# EAGLE design LilyPad_Vibeboard (EAGLE 6.4)
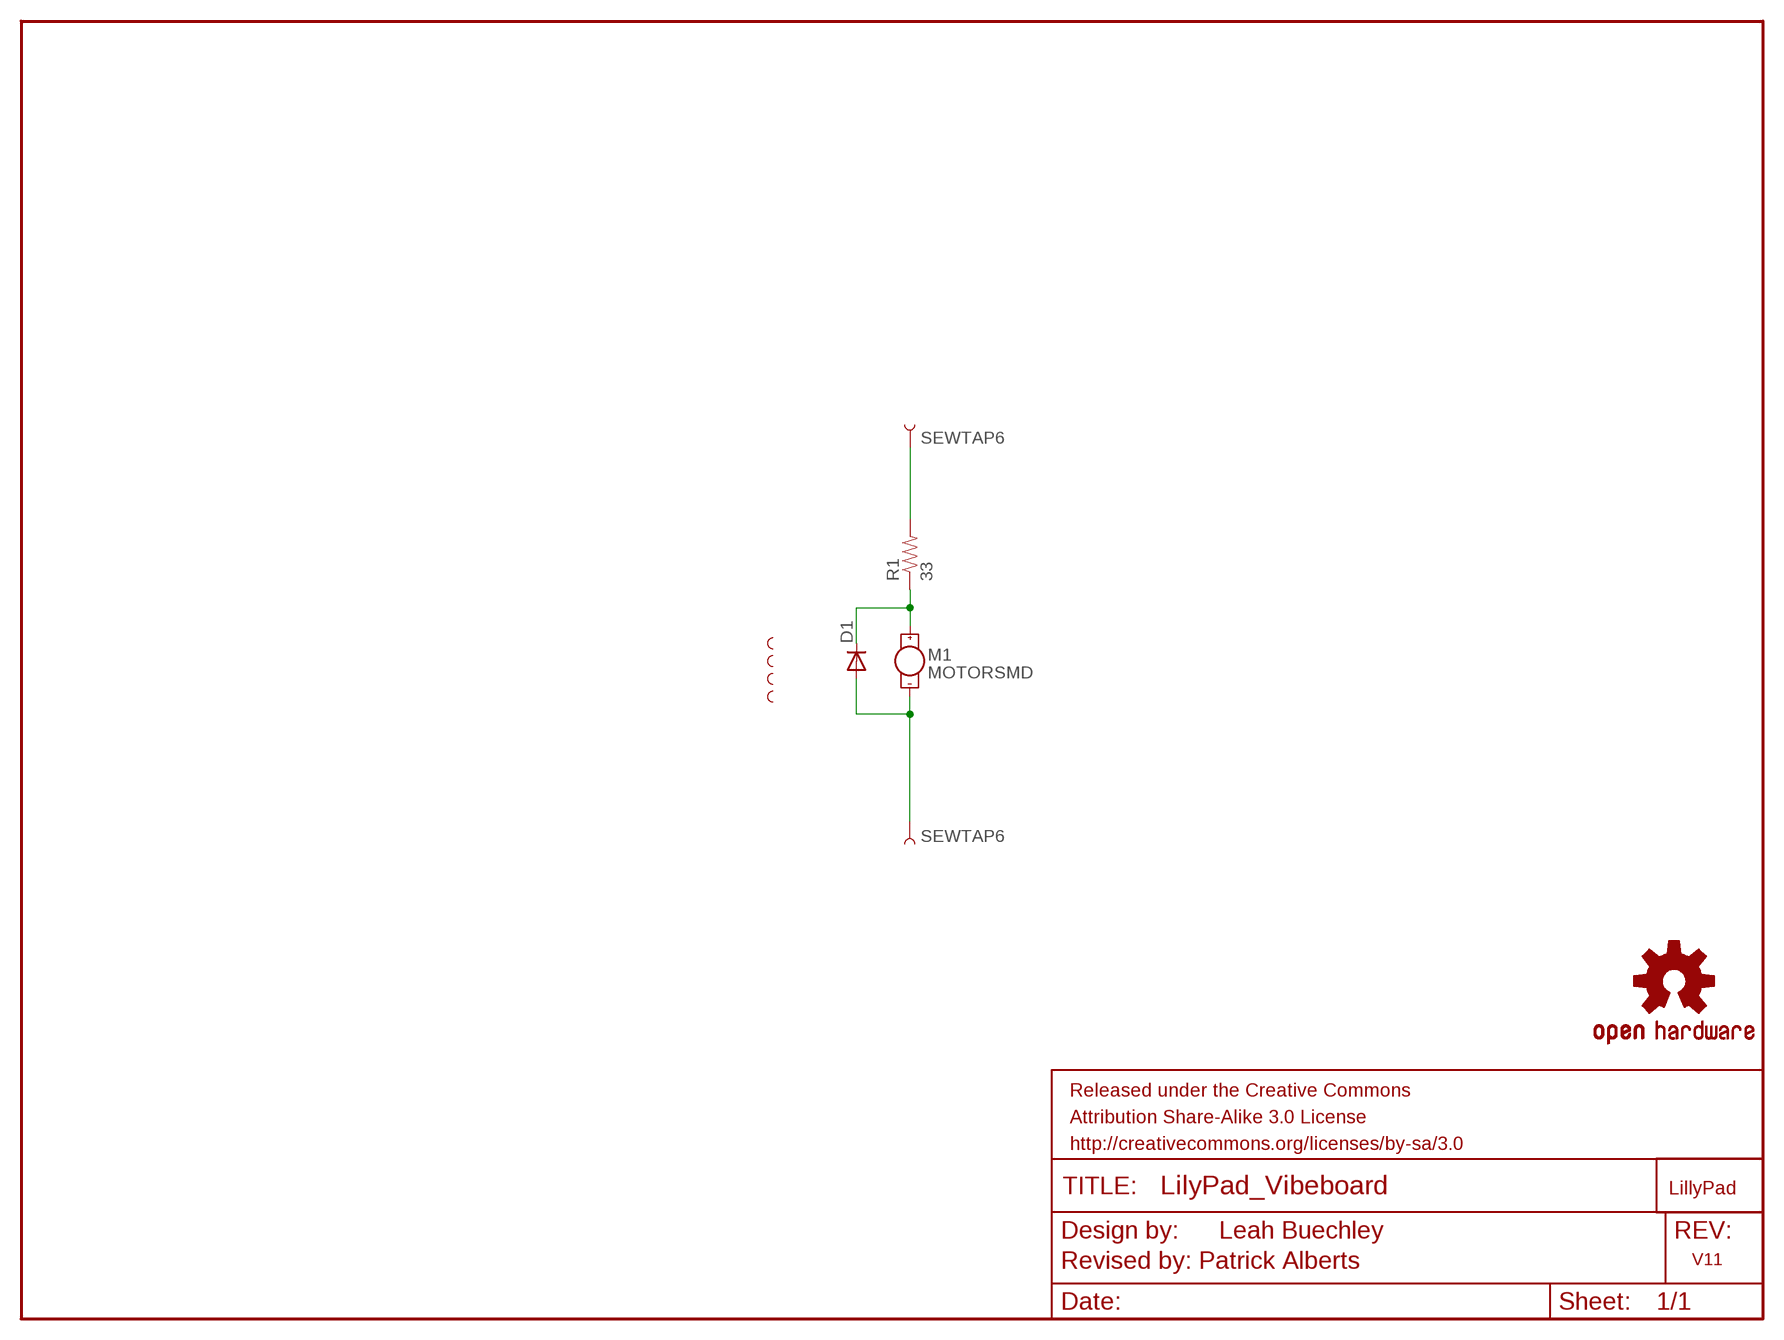
[diagram p0: schematic, sheet 1]

## Parts
D1  DIODESOD  [SOD-323]
FRAME1  FRAME-LETTER  [CREATIVE_COMMONS]
LOGO1  OSHW-LOGOS  [OSHW-LOGO-S]
M1  MOTORSMD  [VIBE-MOTOR-10MM-SMD]
R1  33  33K-1%  [0603-RES]
U$2  LOGO-LPLP  [LOGO-LILYPAD]
VIBE1  SEWTAP-NOHOLE2  [PETAL-NOHOLE-2SIDE]
VIBE2  SEWTAP-NOHOLEW-MASK  [PETAL-NOHOLE-2SIDE-SPECIAL-W-MASK]
VIBE3  SEWTAP-NOHOLE2  [PETAL-NOHOLE-2SIDE]
VIBE4  SEWTAP-NOHOLE2  [PETAL-NOHOLE-2SIDE]
VIBE+  SEWTAP6  [PETAL-SMALL-2SIDE]
VIBE-  SEWTAP6  [PETAL-SMALL-2SIDE]

## Nets
5V: R1.2 VIBE+.1
GND: D1.2(A) M1.P$2(-) VIBE-.1
N$1: D1.1(C) M1.P$1(+) R1.1

## Notes on the sheet
- Leah Buechley
- Revised by: Patrick Alberts | V11

## Library data of the parts
D1 = SparkFun:DIODE: Diode These are standard reverse protection diodes and small signal diodes. SMA package can handle up to about 1A. SOD-323 can handle about 200mA. What the SOD-323 package when ordering, there are some mfgs out there that are 5-pin packages.
FRAME1 = SparkFun-Aesthetics:FRAME-LETTER: Schematic Frame Standard 8.5x11 US Letter frame
LOGO1 = SparkFun-Aesthetics:OSHW-LOGO: Open Source Hardware Logo This logo indicates the piece of hardware it is found on incorporates a OSHW license and/or adheres to the definition of open source hardware found here: http://freedomdefined.org/OSHW
M1 = Testing:MOTOR: Vibration Motor Physical dimension and wire connections for this powerful vibration motor. Motor has a self adhesive backing. Spark Fun Electronics SKU : ROB-08449
R1 = SparkFun-Resistors:33K-1%: 33k-ohm SMT 1/10W - 1% (0603) RES-08416; PROD_ID: RES-08416; VALUE: 33k
U$2 = LilyPad-Wearables:LOGO-LP
VIBE1 VIBE3 VIBE4 = LilyPad-Wearables:SEWTAP-NOHOLE
VIBE2 = Testing:SEWTAP-NOHOLE
VIBE+ VIBE- = LilyPad-Wearables:SEWTAP

## Board
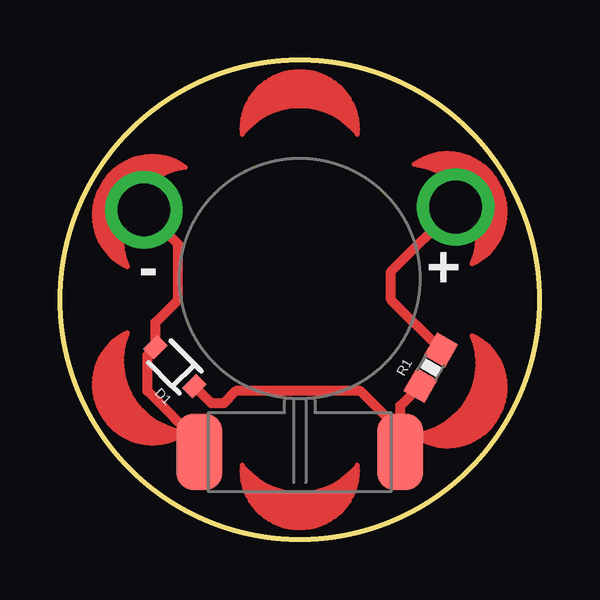
[diagram p1: board, top side]
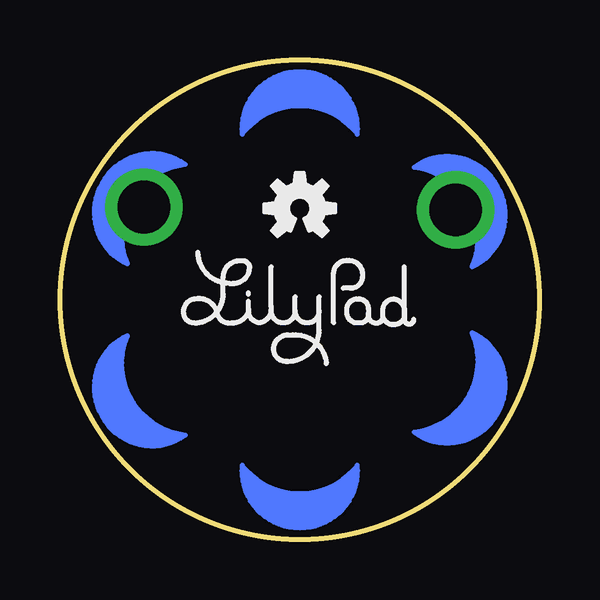
[diagram p2: board, bottom side, seen from below]

Size 20 x 20 mm. Coordinates in mm from the lower left corner, seen from the top.
Outline: circle at 10,10 radius 10
Copper layers (1*16): Top 0.035mm / dielectric 1.5mm / Bottom 0.035mm
Design rules "SparkFun *": minimum track width 7mil, minimum drill 15mil, track to track 8mil, track to pad 8mil, pad to pad 8mil, via to via 8mil, smd to smd 8mil, copper to edge 8mil, drill to drill 8mil, minimum pad ring 12mil, minimum via ring 10mil, stop-mask expansion 4mil, vias tented up to drill 20mil, thermal gap 10mil

### Footprints (pad centres in the part's own frame; a part is rotated, then mirrored left to right if it is on the bottom)
SOD-323 = smd 0.63 x 0.83: 1 -1.15,0; 2 1.15,0
VIBE-MOTOR-10MM-SMD = smd 1.905 x 3.175: P$1 4.191,-7.239; P$2 -4.191,-7.239
0603-RES = smd 1.1 x 1: 1 -0.85,0; 2 0.85,0
PETAL-SMALL-2SIDE = drill 2.2: 1 0,0

### Placement (x,y rotation side)
D1  4.79,7.21 135 top
FRAME1  -88.88,10 0 top  (outside the outline)
LOGO1  10,13.81 0 bottom
M1  10,10.89 0 top
R1  15.47,7.17 60 top
U$2  10,10 0 bottom
VIBE1  3.5,6.25 300 top
VIBE2  10,2.5 0 top
VIBE3  16.5,6.13 60 top
VIBE4  10,17.5 180 top
VIBE+  16.5,13.87 120 top
VIBE-  3.5,13.75 240 top

### Tracks (layer width: path | path; a pad name or v marks a point on that pad's centre or on a via)
5V
  Top 0.406: R1.2 15.89,7.92 13.81,10 13.81,11.18 VIBE+.1
GND
  Top 0.406: M1.P$2 5.81,4.03 3.65,6.19 3.65,7.69 D1.2 3.98,9.06 4.92,10 4.92,12.33 VIBE-.1
N$1
  Top 0.406: R1.1 14.19,5.58 M1.P$1 14.19,4.54 12.54,6.19 7.33,6.19 6.83,5.68 6.32,5.68 D1.1

### Text on the board
tPlace: + | -
tDocu: Leah Buechley | Revised by: Patrick Alberts